# Altium schematic sheet pulsegen.SchDoc
size B
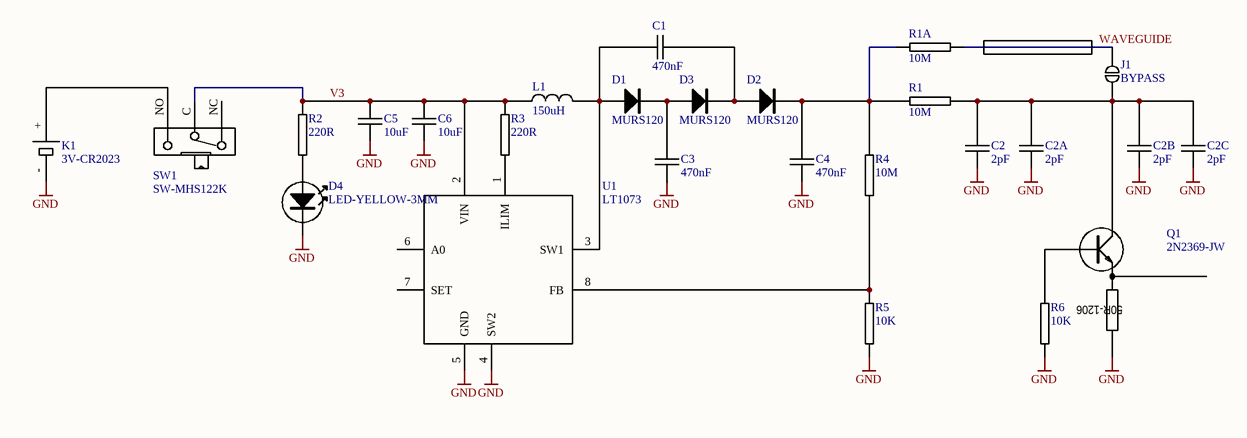
[diagram p0: pulsegen.SchDoc]

## Parts
C1  470nF  [1812C-GENERIC]
C2  2pF  [0805C-GENERIC]
C2A  2pF  [0805C-GENERIC]
C2B  2pF  [0805C-GENERIC]
C2C  2pF  [0805C-GENERIC]
C3  470nF  [1812C-GENERIC]
C4  470nF  [1812C-GENERIC]
C5  10uF  [0805C-GENERIC]
C6  10uF  [0805C-GENERIC]
D1  MURS120  [DIODE-SMB]
D2  MURS120  [DIODE-SMB]
D3  MURS120  [DIODE-SMB]
D4  LED-YELLOW-3MM  [LED-3MM-YELLOW]
J1  BYPASS  [BYPASS]
K1  3V-CR2023  [BATCLIP-CR2032]
L1  150uH  [TOKO-NR4018]
Q1  2N2369-JW  [JW2N2369]
R1  10M  [0805R-TBD]
R1A  10M  [0805R-TBD]
R2  220R  [0805R-220]
R3  220R  [0805R-220]
R4  10M  [0805R-TBD]
R5  10K  [0805R-10K]
R6  10K  [0805R-10K]
SW1  SW-MHS122K  [MHS122K]
U1  LT1073  [SO8]

## Nets
GND: C2.2 C2A.2 C2B.2 C2C.2 C3.1 C4.1 C5.2 C6.2 D4.K K1.- Q1.G R5.2 R6.2 U1.4(SW2) U1.5(GND)
V3: C5.1 C6.1 L1.1 R2.1 R3.1 SW1.C U1.2(VIN)
WAVEGUIDE: J1.1 R1A.2
NetC1_1: C1.1 D1.A L1.2 U1.3(SW1)
NetC1_2: C1.2 D2.A D3.K
NetC2_1: C2.1 C2A.1 C2B.1 C2C.1 J1.2 Q1.C R1.2
NetC3_2: C3.2 D1.K D3.A
NetC4_2: C4.2 D2.K R1.1 R1A.1 R4.1
NetD4_A: D4.A R2.2
NetK1_+: K1.+ SW1.NO
NetQ1_B: Q1.B R6.1
NetR3_2: R3.2 U1.1(ILIM)
NetR4_2: R4.2 R5.1 U1.8(FB)

Not connected (* = marked no-connect by the designer): SW1 NC(NC2); U1 6(A0) 7(SET)

## Notes on the sheet
- (in symbol 2N2369-JW) 50R-1206

## Library data of the parts
C1 C3 C4 = 1812C-470nF-250V-X7R-MUR: CAPACITOR 1812 CERAMIC; Supplier 1: Digi-Key; Supplier Part Number 1: 490-3549-1-ND
C2 C2A C2B C2C C5 C6 = 0805C-10UF-6V3-X5R-PAN: CAPACITOR 0805 CERAMIC; Manufacturer: Panasonic - ECG; Manufacturer Part Number: ECJ-2FB0J106M; Reel: C1; Capacitance: 10µF; Voltage - Rated: 6.3V; Temperature Coefficient: X5R; Tolerance: ±20%; Description: CAP 10UF 6.3V CERAMIC X5R 0805; Supplier 1: Digi-Key; Supplier Part Number 1: PCC2225TR-ND; Supplier: Digi-Key; Operating Temperature: -55°C ~ 85°C; Mounting Type: Surface Mount, MLCC; Lead Spacing: -; RoHS: RoHS Compliant; Packaging: Tape & Reel (TR); Thickness: 1.25mm; Package / Case: 0805 (2012 metric); Features: General Purpose; Category: Capacitors; Supplier Part Number: PCC2225TR-ND
D1-D3 = MURS120: DIODE; Supplier 1: Digi-Key; Supplier Part Number 1: MURS120-E3/52TGITR-ND
J1 = BYPASS: SOLDERDOT BYPASS; Manufacturer Part Number 1: Board Feature; Reel: Open; Description: Solderdot; Supplier 1: Solder-it-yourself; Manufacturer 1: Board feature
K1 = BATCLIP-CR2032-SMD: BU2032SM-HD-G; Supplier 1: Digi-Key; Supplier Part Number 1: BU2032SM-HD-GDKR-ND
L1 = 150U-NR4018-TOKO: Supplier 1: Mouser; Supplier Part Number 1: 963-NR4018T151M
R1 R1A R4 = 0805R-10M: RESISTOR 0805 VALUE TO BE DETERMINED; Supplier 1: Digi-Key; Supplier Part Number 1: HVCB0805FKD10M0-ND
R2 R3 = 0805R-220R: RESISTOR 0805 1/4 WATT THIN FILM; Reel: *
R5 R6 = 0805R-10K: RESISTOR 0805 1/4 WATT THIN FILM; Reel: *
SW1 = SW-MHS122K: SWITCH DPDT; Supplier 1: Digi-Key; Supplier Part Number 1: 679-1866-ND
Q1 = 2N2369-JW: Supplier 1: Mouser; Supplier Part Number 1: 610-2N2369A